# Altium schematic sheet MCU.SchDoc: MCU
size A4; Revision: 1.0; SheetNumber: 3; SheetTotal: 11; Class: B
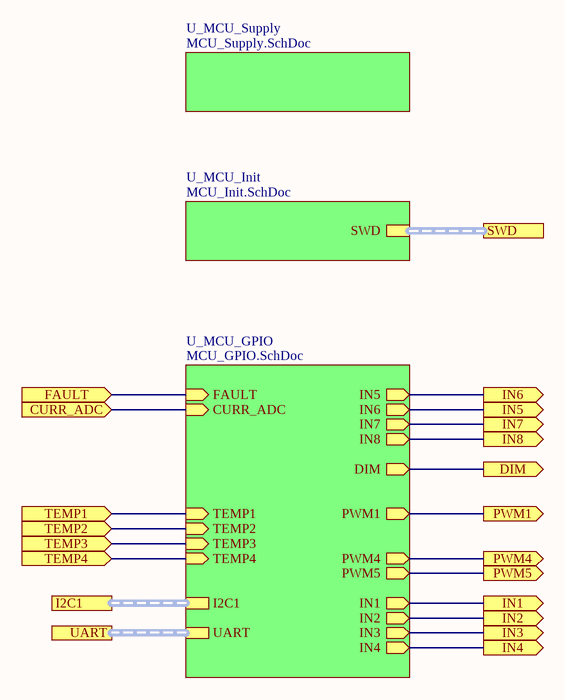
[diagram p0: MCU.SchDoc]

## Sub-sheets
U_MCU_GPIO = MCU_GPIO.SchDoc: CURR_ADC (in), DIM (out), FAULT (in), TEMP1 (in), TEMP3 (in), TEMP4 (in), TEMP2 (in), UART (harness UART), PWM1 (out), PWM4 (out), PWM5 (out), IN1 (out), IN2 (out), IN3 (out), IN4 (out), IN6 (out), IN5 (out), IN7 (out), IN8 (out), I2C1 (harness I2C1)
U_MCU_Init = MCU_Init.SchDoc: SWD (harness SWD)
U_MCU_Supply = MCU_Supply.SchDoc: no entries

## Ports
CURR_ADC (in), DIM (out), FAULT (in), I2C1, IN1 (out), IN2 (out), IN3 (out), IN4 (out), IN5 (out), IN6 (out), IN7 (out), IN8 (out), PWM1 (out), PWM4 (out), PWM5 (out), SWD (harness SWD), TEMP1 (in), TEMP2 (in), TEMP3 (in), TEMP4 (in), UART (harness UART)

## Nets
CURR_ADC: port CURR_ADC, sheet U_MCU_GPIO/CURR_ADC
DIM: port DIM, sheet U_MCU_GPIO/DIM
FAULT: port FAULT, sheet U_MCU_GPIO/FAULT
IN1: port IN1, sheet U_MCU_GPIO/IN1
IN2: port IN2, sheet U_MCU_GPIO/IN2
IN3: port IN3, sheet U_MCU_GPIO/IN3
IN4: port IN4, sheet U_MCU_GPIO/IN4
IN5: port IN5, sheet U_MCU_GPIO/IN6
IN6: port IN6, sheet U_MCU_GPIO/IN5
IN7: port IN7, sheet U_MCU_GPIO/IN7
IN8: port IN8, sheet U_MCU_GPIO/IN8
PWM1: port PWM1, sheet U_MCU_GPIO/PWM1
PWM4: port PWM4, sheet U_MCU_GPIO/PWM4
PWM5: port PWM5, sheet U_MCU_GPIO/PWM5
TEMP1: port TEMP1, sheet U_MCU_GPIO/TEMP1
TEMP2: port TEMP2, sheet U_MCU_GPIO/TEMP2
TEMP3: port TEMP3, sheet U_MCU_GPIO/TEMP3
TEMP4: port TEMP4, sheet U_MCU_GPIO/TEMP4

## Buses and harness runs
harness port I2C1 = sheet U_MCU_GPIO/I2C1
harness port SWD = sheet U_MCU_Init/SWD
harness port UART = sheet U_MCU_GPIO/UART

## Notes on the sheet
- Title:
- Date:
- Revision:
- Class:
- Sheet
- of